# Altium schematic sheet power.SchDoc
size 508 x 241 mm; SheetNumber: 2; SheetTotal: 6
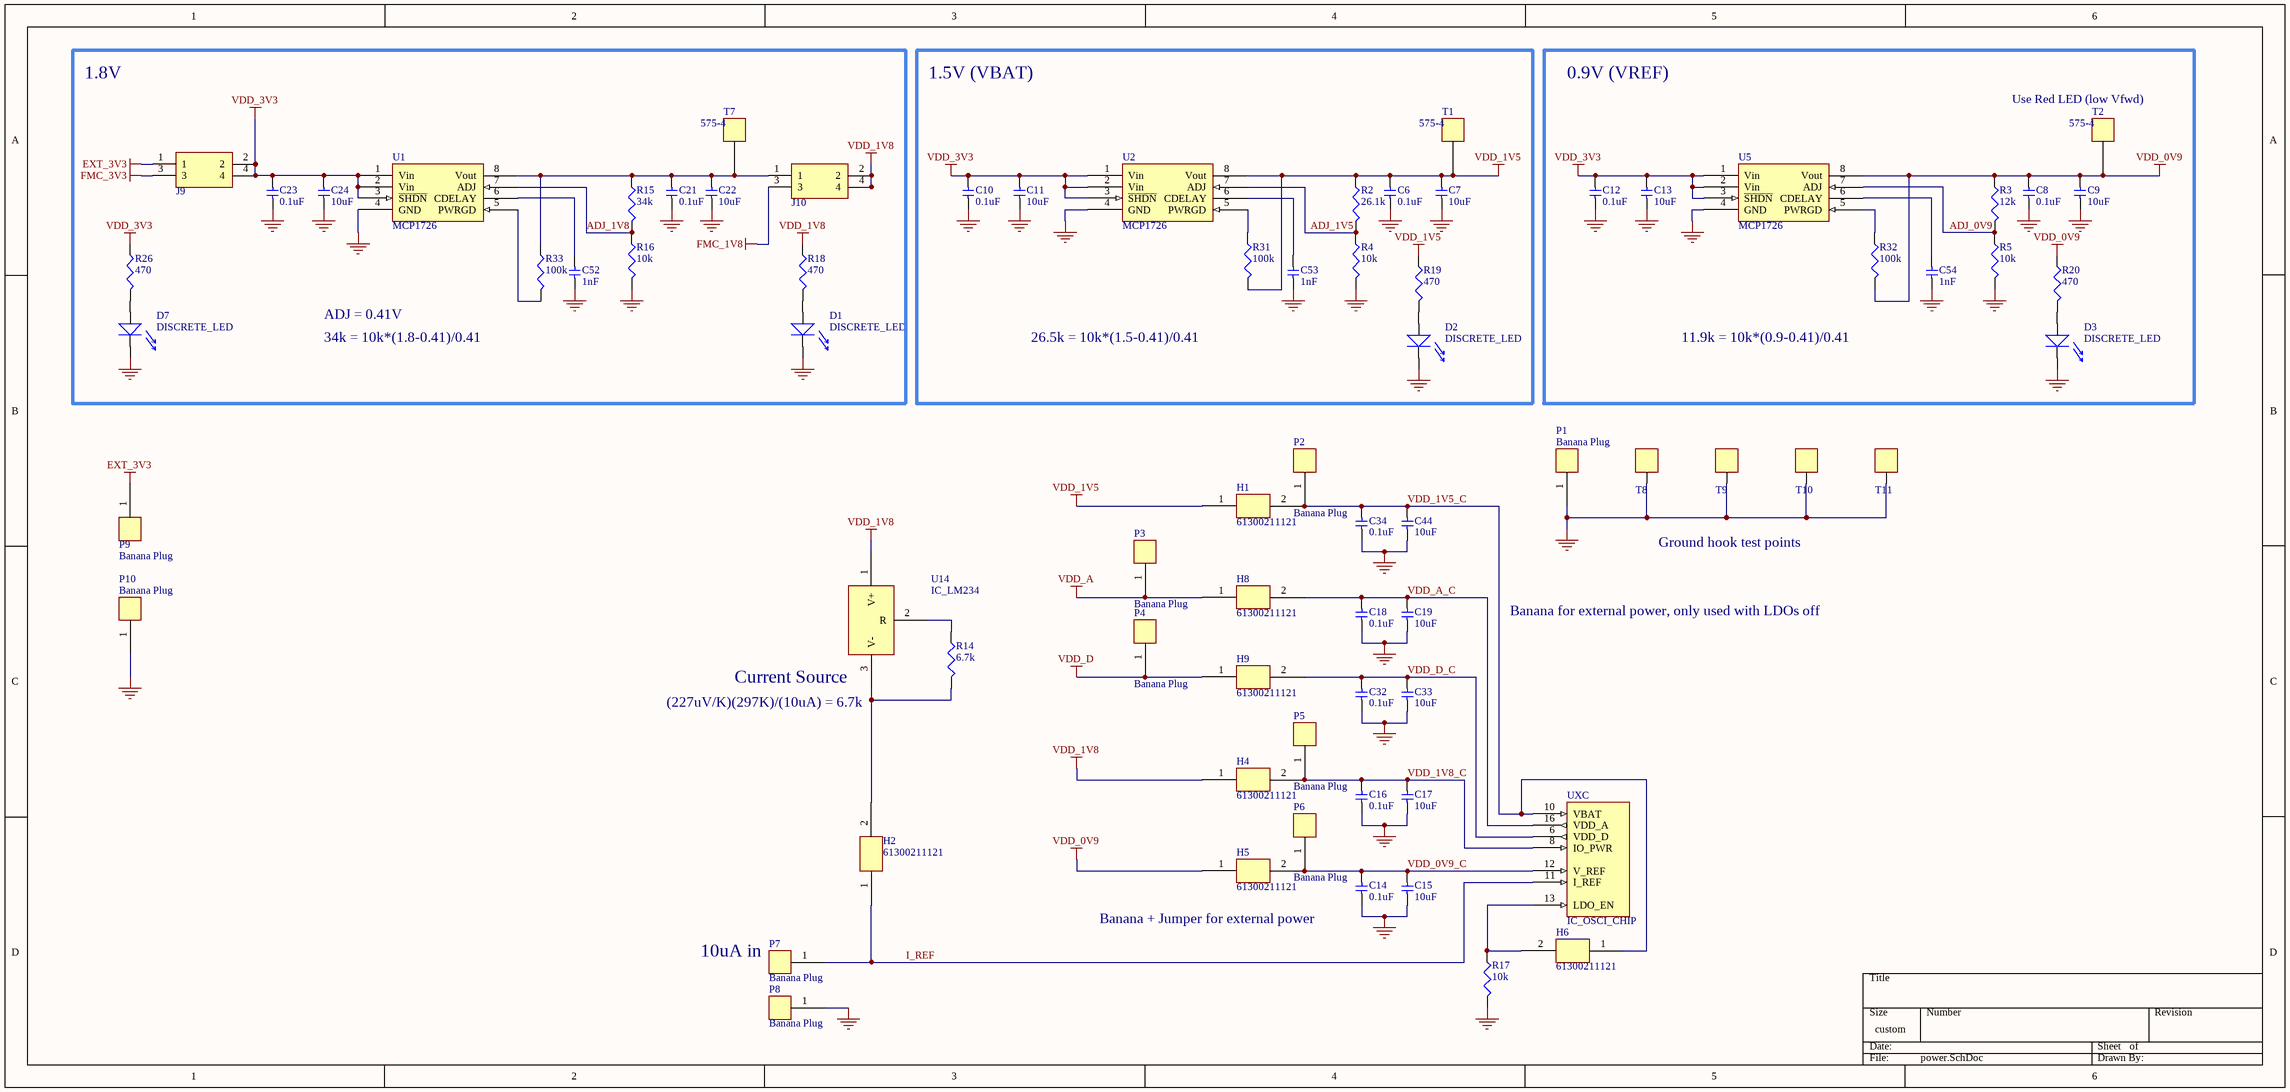
[diagram p0: power.SchDoc]

## Parts
C6  0.1uF  [0603]
C7  10uF  [0603]
C8  0.1uF  [0603]
C9  10uF  [0603]
C10  0.1uF  [0603]
C11  10uF  [0603]
C12  0.1uF  [0603]
C13  10uF  [0603]
C14  0.1uF  [0603]
C15  10uF  [0603]
C16  0.1uF  [0603]
C17  10uF  [0603]
C18  0.1uF  [0603]
C19  10uF  [0603]
C21  0.1uF  [0603]
C22  10uF  [0603]
C23  0.1uF  [0603]
C24  10uF  [0603]
C32  0.1uF  [0603]
C33  10uF  [0603]
C34  0.1uF  [0603]
C44  10uF  [0603]
C52  1nF  [0603]
C53  1nF  [0603]
C54  1nF  [0603]
D1  DISCRETE_LED  [LED-1206]
D2  DISCRETE_LED  [LED-1206]
D3  DISCRETE_LED  [LED-1206]
D7  DISCRETE_LED  [LED-1206]
H1  61300211121  [CON-002-100-200X100/1X2-POST]
H2  61300211121  [CON-002-100-200X100/1X2-POST]
H4  61300211121  [CON-002-100-200X100/1X2-POST]
H5  61300211121  [CON-002-100-200X100/1X2-POST]
H6  61300211121  [CON-002-100-200X100/1X2-POST]
H8  61300211121  [CON-002-100-200X100/1X2-POST]
H9  61300211121  [CON-002-100-200X100/1X2-POST]
J9  Con 4 pins 2x2  [CON-004-100-200X200/2X2-POST]  (value not drawn)
J10  Con 4 pins 2x2  [CON-004-100-200X200/2X2-POST]  (value not drawn)
P1  Banana Plug  [CON-001-312X312/BANANA-JACK]
P2  Banana Plug  [CON-001-312X312/BANANA-JACK]
P3  Banana Plug  [CON-001-312X312/BANANA-JACK]
P4  Banana Plug  [CON-001-312X312/BANANA-JACK]
P5  Banana Plug  [CON-001-312X312/BANANA-JACK]
P6  Banana Plug  [CON-001-312X312/BANANA-JACK]
P7  Banana Plug  [CON-001-312X312/BANANA-JACK]
P8  Banana Plug  [CON-001-312X312/BANANA-JACK]
P9  Banana Plug  [CON-001-312X312/BANANA-JACK]
P10  Banana Plug  [CON-001-312X312/BANANA-JACK]
R2  26.1k  [0603]
R3  12k  [0603]
R4  10k  [0603]
R5  10k  [0603]
R14  6.7k  [0603]
R15  34k  [0603]
R16  10k  [0603]
R17  10k  [0603]
R18  470  [0603]
R19  470  [0603]
R20  470  [0603]
R26  470  [0603]
R31  100k  [0603]
R32  100k  [0603]
R33  100k  [0603]
T1  575-4  [TP-100X100/ROUND-THT]
T2  575-4  [TP-100X100/ROUND-THT]
T7  575-4  [TP-100X100/ROUND-THT]
T8  Test point 1 pin  [TP-100X100/ROUND-THT]  (value not drawn)
T9  Test point 1 pin  [TP-100X100/ROUND-THT]  (value not drawn)
T10  Test point 1 pin  [TP-100X100/ROUND-THT]  (value not drawn)
T11  Test point 1 pin  [TP-100X100/ROUND-THT]  (value not drawn)
U1  MCP1726  [SOIC-8]
U2  MCP1726  [SOIC-8]
U5  MCP1726  [SOIC-8]
U14  IC_LM234  [TO-92]
UX  IC_OSCI_CHIP  [QFN-48-.4-6.0X6.0-LP]  (part C of 4)

## Blocks framed on the sheet
1.8V: C21-C24 C52 D1 D7 J9 J10 R15 R16 R18 R26 R33 T7 U1
1.5V (VBAT): C6 C7 C10 C11 C53 D2 R2 R4 R19 R31 T1 U2
0.9V (VREF): C8 C9 C12 C13 C54 D3 R3 R5 R20 R32 T2 U5

## Nets
EXT_3V3: J9.1 P9.1
FMC_1V8: J10.3
FMC_3V3: J9.3
GND: C6.2 C7.2 C8.2 C9.2 C10.2 C11.2 C12.2 C13.2 C14.2 C15.2 C16.2 C17.2 C18.2 C19.2 C21.2 C22.2 C23.2 C24.2 C32.2 C33.2 C34.2 C44.2 C52.2 C53.2 C54.2 D1.1 D2.1 D3.1 D7.1 P1.1 P8.1 P10.1 R4.2 R5.2 R16.2 R17.2 T8.1 T9.1 T10.1 T11.1 U1.4(GND) U2.4(GND) U5.4(GND)
VDD_0V9: C8.1 C9.1 H5.1 R3.1 R20.1 R32.2 T2.1 U5.8(Vout)
VDD_1V5: C6.1 C7.1 H1.1 R2.1 R19.1 R31.2 T1.1 U2.8(Vout)
VDD_1V8: H4.1 J10.2 J10.4 R18.1 U14.1(V+)
VDD_3V3: C10.1 C11.1 C12.1 C13.1 C23.1 C24.1 J9.2 J9.4 R26.1 U1.1(Vin) U1.2(Vin) U1.3(~{SHDN}) U2.1(Vin) U2.2(Vin) U2.3(~{SHDN}) U5.1(Vin) U5.2(Vin) U5.3(~{SHDN})
VDD_A: H8.1 P3.1
VDD_D: H9.1 P4.1
ADJ_0V9: R3.2 R5.1 U5.7(ADJ)
ADJ_1V5: R2.2 R4.1 U2.7(ADJ)
ADJ_1V8: R15.2 R16.1 U1.7(ADJ)
I_REF: H2.1 P7.1 UX.11(I_REF)
VDD_0V9_C: C14.1 C15.1 H5.2 P6.1 UX.12(V_REF)
VDD_1V5_C: C34.1 C44.1 H1.2 H6.1 P2.1 UX.10(VBAT)
VDD_1V8_C: C16.1 C17.1 H4.2 P5.1 UX.8(IO_PWR)
VDD_A_C: C18.1 C19.1 H8.2 UX.16(VDD_A)
VDD_D_C: C32.1 C33.1 H9.2 UX.6(VDD_D)
NetC21_1: C21.1 C22.1 J10.1 R15.1 R33.1 T7.1 U1.8(Vout)
NetC52_1: C52.1 U1.6(CDELAY)
NetC53_1: C53.1 U2.6(CDELAY)
NetC54_1: C54.1 U5.6(CDELAY)
NetD1_2: D1.2 R18.2
NetD2_2: D2.2 R19.2
NetD3_2: D3.2 R20.2
NetD7_2: D7.2 R26.2
NetH2_2: H2.2 R14.2 U14.3(V-)
NetH6_2: H6.2 R17.1 UX.13(LDO_EN)
NetR14_1: R14.1 U14.2(R)
NetR31_1: R31.1 U2.5(PWRGD)
NetR32_1: R32.1 U5.5(PWRGD)
NetR33_2: R33.2 U1.5(PWRGD)

## Notes on the sheet
- (near T2) Use Red LED (low Vfwd)
- ADJ = 0.41V
- 34k = 10k*(1.8-0.41)/0.41
- 26.5k = 10k*(1.5-0.41)/0.41
- 11.9k = 10k*(0.9-0.41)/0.41
- Ground hook test points
- Banana for external power, only used with LDOs off
- (near U14) (227uV/K)(297K)/(10uA) = 6.7k
- (near U14) Current Source
- Banana + Jumper for external power
- (near P7) 10uA in

## Library data of the parts
C6 C8 C10 C12 C14 C16 C18 C21 C23 C32 C34 C52-C54 = DISCRETE_C: 0.1uF 0402
C7 C9 C11 C13 C15 C17 C19 C22 C24 C33 C44 = DISCRETE_C: 10uF 0603
D1-D3 D7 = DISCRETE_LED: LED generic
J9 J10 = CON_004pin_2x2
R2-R5 R15 R16 R18-R20 R26 R31-R33 = DISCRETE_R: 200 0402
R14 R17 = DISCRETE_R: Resistor generic
T1 T2 T7 = TEST_PT: Test point
T8-T11 = TEST_PT
U1 U2 U5 = MCP1726: 1A, Low-Voltage, Low Quiescent Current LDO Regulator
U14 = IC_LM234: 3-Terminal Adjustable Current Sources
UX = IC_OSCI_CHIP: EE290C Tapeout Class IC